# Altium schematic sheet FPGAGTP.SchDoc: Kasli-DIOT
size 420 x 297 mm; EDA_Number: ARTIQ; Projet: ARTIQ/SINARA; Author: G.Kasprowicz; CompanyName: WUT ISE; DrawnBy: F.Świtakowski; Organization: WUT ISE; Address1: PW ISE; Address2: Nowowiejska 15/19 00-665 Warsaw; Address3: gkasprow@gmail.com; DocumentNumber: 2; SheetNumber: 3; SheetTotal: 16; ModifiedBy: -; CheckedDate: -; Title2: FPGAGTP; DivGrp: WUT ISE; Designer: F.Świtakowski; ModifiedDate: -; ProjectName: Sensor Box
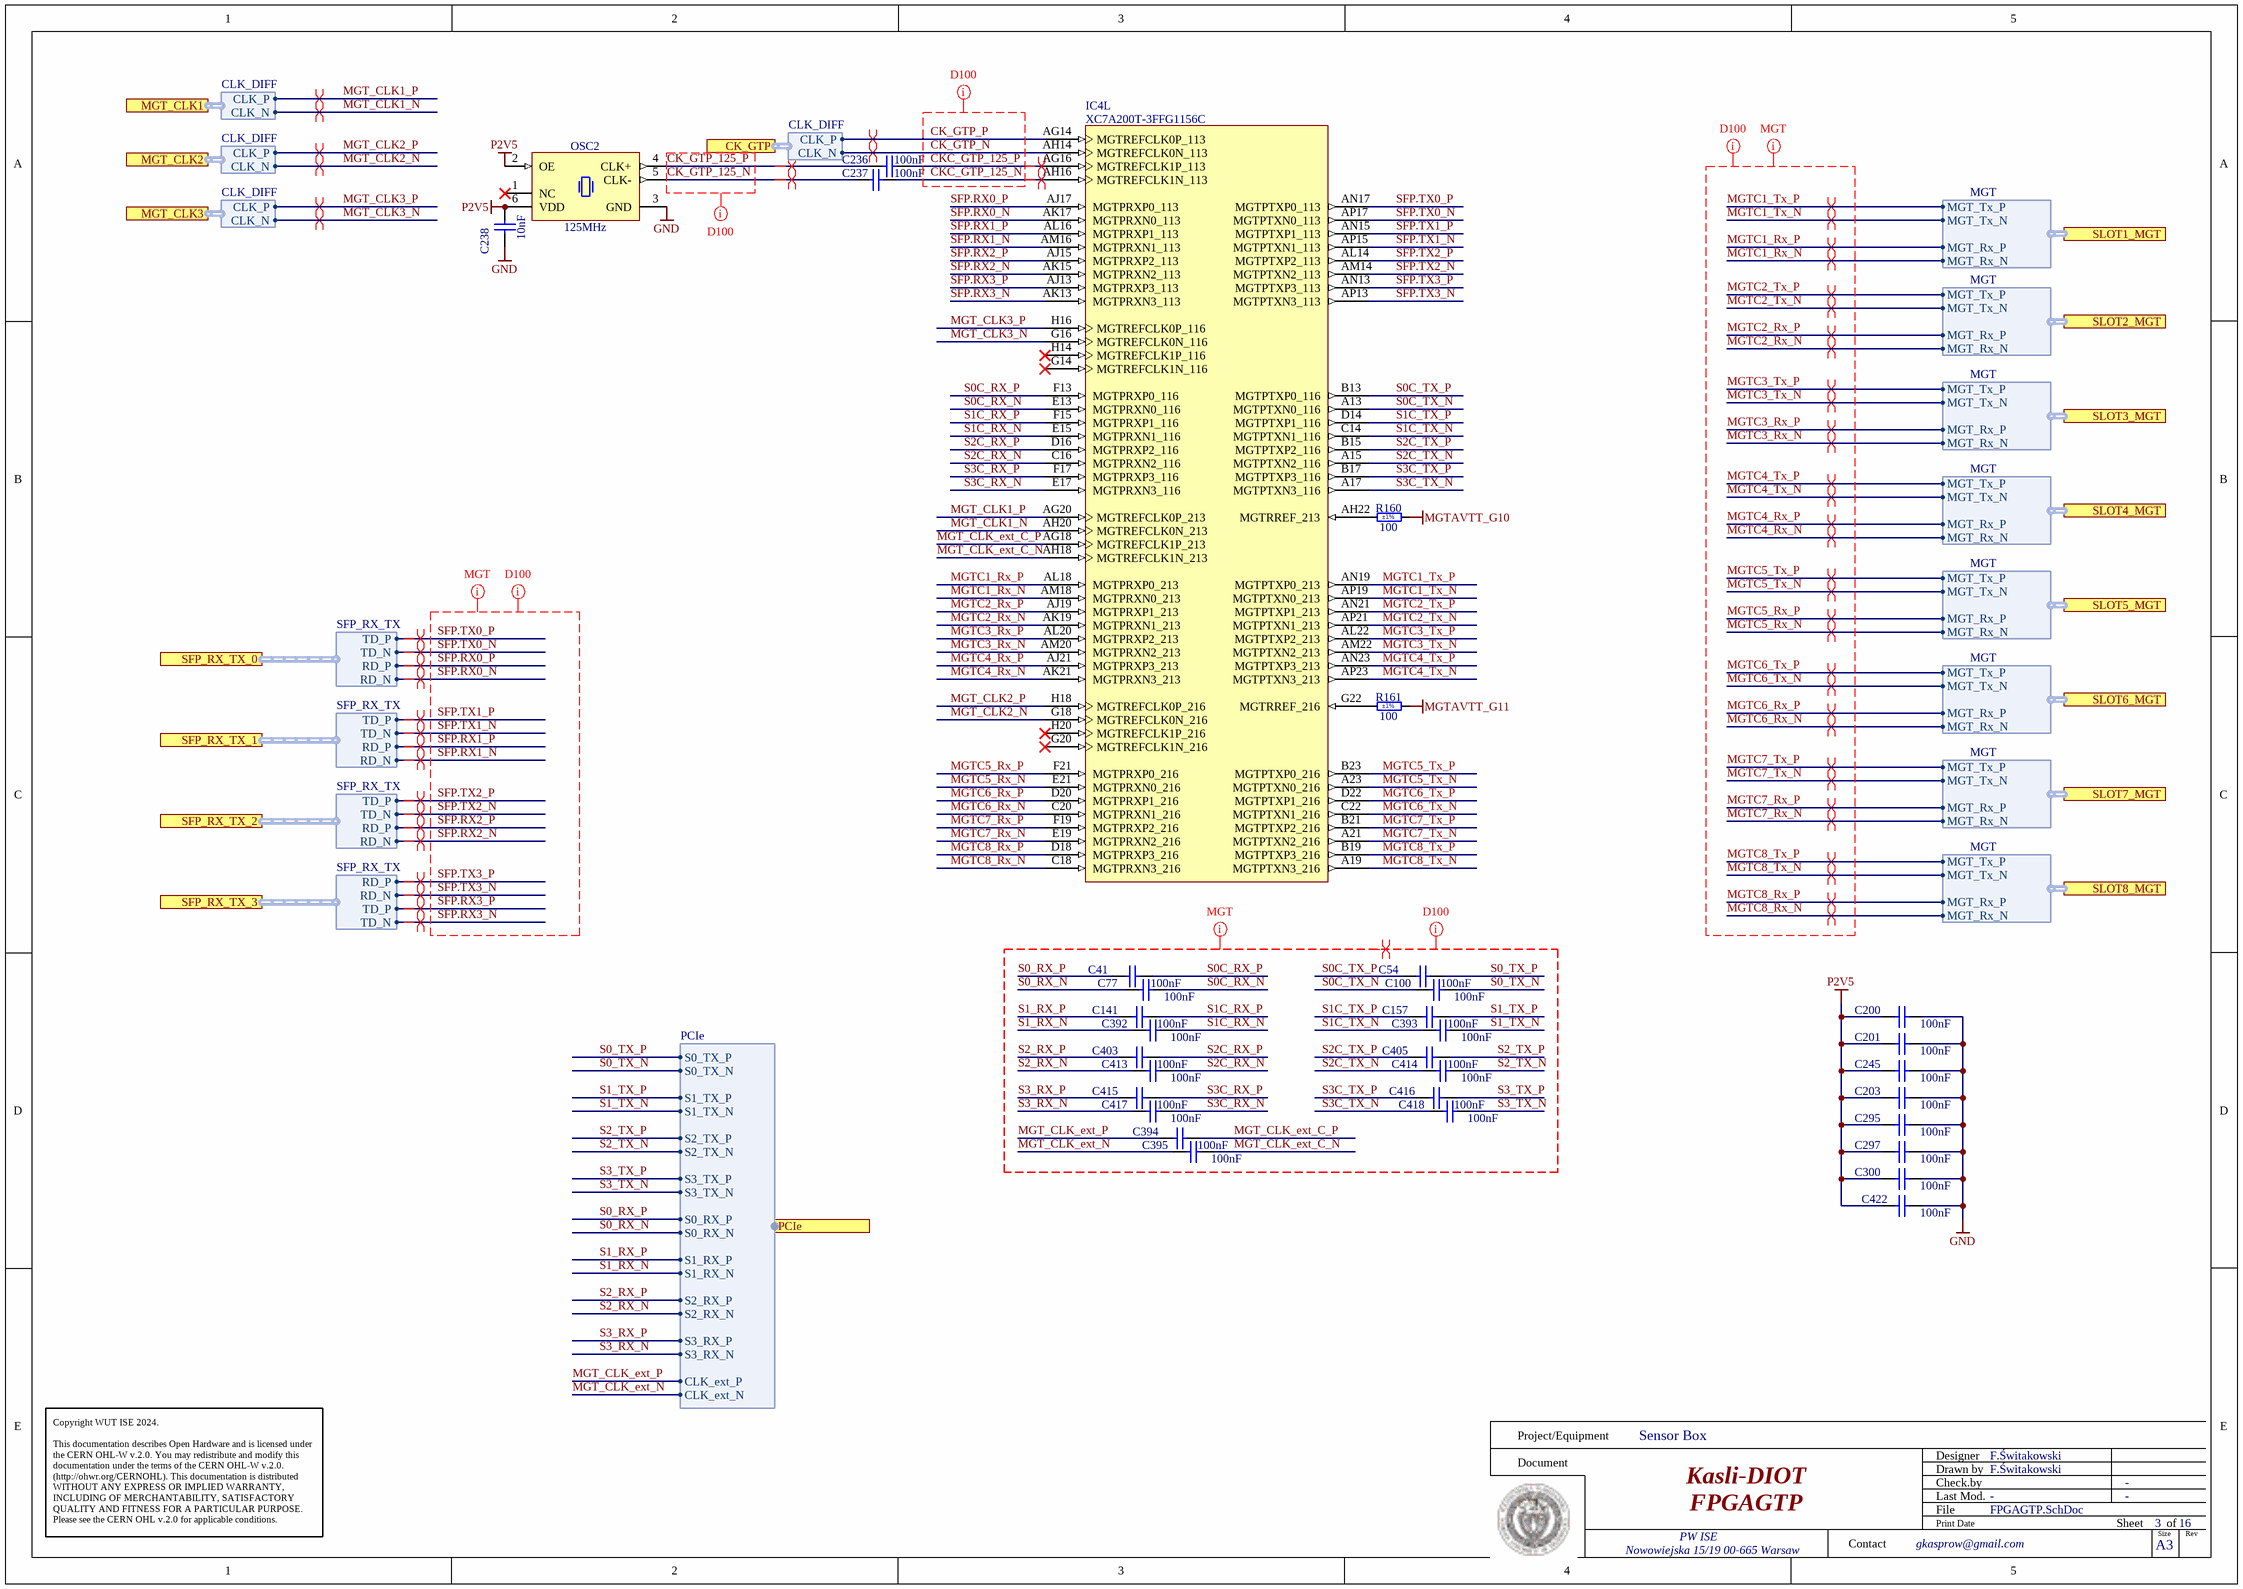
[diagram p0: FPGAGTP.SchDoc]

## Parts
C41  100nF  [CAPC0603X33N]
C54  100nF  [CAPC0603X33N]
C77  100nF  [CAPC0603X33N]
C100  100nF  [CAPC0603X33N]
C141  100nF  [CAPC0603X33N]
C157  100nF  [CAPC0603X33N]
C200  100nF  [CAPC0603X33N]
C201  100nF  [CAPC0603X33N]
C203  100nF  [CAPC0603X33N]
C236  100nF  [CAPC0603X33N]
C237  100nF  [CAPC0603X33N]
C238  10nF  [CAPC1005X55N]
C245  100nF  [CAPC0603X33N]
C295  100nF  [CAPC0603X33N]
C297  100nF  [CAPC0603X33N]
C300  100nF  [CAPC0603X33N]
C392  100nF  [CAPC0603X33N]
C393  100nF  [CAPC0603X33N]
C394  100nF  [CAPC0603X33N]
C395  100nF  [CAPC0603X33N]
C403  100nF  [CAPC0603X33N]
C405  100nF  [CAPC0603X33N]
C413  100nF  [CAPC0603X33N]
C414  100nF  [CAPC0603X33N]
C415  100nF  [CAPC0603X33N]
C416  100nF  [CAPC0603X33N]
C417  100nF  [CAPC0603X33N]
C418  100nF  [CAPC0603X33N]
C422  100nF  [CAPC0603X33N]
IC4  XC7A200T-3FFG1156C  [BGA1156C100P34X34_3500X3500X310]  (part L of 18)
OSC2  125MHz  [OSC_SILICON-LAB_SI510-6N]
R160  100  Tolerance: ±1%  [RESC0603X28N]
R161  100  Tolerance: ±1%  [RESC0603X28N]

## Ports
CK_GTP (harness CLK_DIFF), MGT_CLK1 (harness CLK_DIFF), MGT_CLK2 (harness CLK_DIFF), MGT_CLK3 (harness CLK_DIFF), PCIe (harness PCIe), SFP_RX_TX_0 (harness SFP_RX_TX), SFP_RX_TX_1 (harness SFP_RX_TX), SFP_RX_TX_2 (harness SFP_RX_TX), SFP_RX_TX_3 (harness SFP_RX_TX), SLOT1_MGT (harness MGT), SLOT2_MGT (harness MGT), SLOT3_MGT (harness MGT), SLOT4_MGT (harness MGT), SLOT5_MGT (harness MGT), SLOT6_MGT (harness MGT), SLOT7_MGT (harness MGT), SLOT8_MGT (harness MGT)

## Harnesses
SFP_RX_TX: RD_N, RD_P, TD_N, TD_P
MGT: MGT_Tx_P, MGT_Tx_N, MGT_Rx_P, MGT_Rx_N
CLK_DIFF: CLK_P, CLK_N
PCIe: S0_TX_P, S0_TX_N, S1_TX_P, S1_TX_N, S2_TX_P, S2_TX_N, S3_TX_P, S3_TX_N, S0_RX_P, S0_RX_N, S1_RX_P, S1_RX_N, S2_RX_P, S2_RX_N, S3_RX_P, S3_RX_N, CLK_ext_P, CLK_ext_N

## Nets
GND: C200.2 C201.2 C203.2 C238.1 C245.2 C295.2 C297.2 C300.2 C422.2 OSC2.3(GND)
MGTAVTT_G10: R160.2
MGTAVTT_G11: R161.2
P2V5: C200.1 C201.1 C203.1 C238.2 C245.1 C295.1 C297.1 C300.1 C422.1 OSC2.2(OE) OSC2.6(VDD)
CK_GTP_125_N: C237.1 OSC2.5(CLK-)
CK_GTP_125_P: C236.1 OSC2.4(CLK+)
CK_GTP_N: IC4.AH14(MGTREFCLK0N_113) ; port CK_GTP.CLK_N
CK_GTP_P: IC4.AG14(MGTREFCLK0P_113) ; port CK_GTP.CLK_P
CKC_GTP_125_N: C237.2 IC4.AH16(MGTREFCLK1N_113)
CKC_GTP_125_P: C236.2 IC4.AG16(MGTREFCLK1P_113)
MGT_CLK1_N: IC4.AH20(MGTREFCLK0N_213) ; port MGT_CLK1.CLK_N
MGT_CLK1_P: IC4.AG20(MGTREFCLK0P_213) ; port MGT_CLK1.CLK_P
MGT_CLK2_N: IC4.G18(MGTREFCLK0N_216) ; port MGT_CLK2.CLK_N
MGT_CLK2_P: IC4.H18(MGTREFCLK0P_216) ; port MGT_CLK2.CLK_P
MGT_CLK3_N: IC4.G16(MGTREFCLK0N_116) ; port MGT_CLK3.CLK_N
MGT_CLK3_P: IC4.H16(MGTREFCLK0P_116) ; port MGT_CLK3.CLK_P
MGT_CLK_ext_C_N: C395.2 IC4.AH18(MGTREFCLK1N_213)
MGT_CLK_ext_C_P: C394.2 IC4.AG18(MGTREFCLK1P_213)
MGT_CLK_ext_N: C395.1 ; port PCIe.CLK_ext_N
MGT_CLK_ext_P: C394.1 ; port PCIe.CLK_ext_P
MGTC1_Rx_N: IC4.AM18(MGTPRXN0_213) ; port SLOT1_MGT.MGT_Rx_N
MGTC1_Rx_P: IC4.AL18(MGTPRXP0_213) ; port SLOT1_MGT.MGT_Rx_P
MGTC1_Tx_N: IC4.AP19(MGTPTXN0_213) ; port SLOT1_MGT.MGT_Tx_N
MGTC1_Tx_P: IC4.AN19(MGTPTXP0_213) ; port SLOT1_MGT.MGT_Tx_P
MGTC2_Rx_N: IC4.AK19(MGTPRXN1_213) ; port SLOT2_MGT.MGT_Rx_N
MGTC2_Rx_P: IC4.AJ19(MGTPRXP1_213) ; port SLOT2_MGT.MGT_Rx_P
MGTC2_Tx_N: IC4.AP21(MGTPTXN1_213) ; port SLOT2_MGT.MGT_Tx_N
MGTC2_Tx_P: IC4.AN21(MGTPTXP1_213) ; port SLOT2_MGT.MGT_Tx_P
MGTC3_Rx_N: IC4.AM20(MGTPRXN2_213) ; port SLOT3_MGT.MGT_Rx_N
MGTC3_Rx_P: IC4.AL20(MGTPRXP2_213) ; port SLOT3_MGT.MGT_Rx_P
MGTC3_Tx_N: IC4.AM22(MGTPTXN2_213) ; port SLOT3_MGT.MGT_Tx_N
MGTC3_Tx_P: IC4.AL22(MGTPTXP2_213) ; port SLOT3_MGT.MGT_Tx_P
MGTC4_Rx_N: IC4.AK21(MGTPRXN3_213) ; port SLOT4_MGT.MGT_Rx_N
MGTC4_Rx_P: IC4.AJ21(MGTPRXP3_213) ; port SLOT4_MGT.MGT_Rx_P
MGTC4_Tx_N: IC4.AP23(MGTPTXN3_213) ; port SLOT4_MGT.MGT_Tx_N
MGTC4_Tx_P: IC4.AN23(MGTPTXP3_213) ; port SLOT4_MGT.MGT_Tx_P
MGTC5_Rx_N: IC4.E21(MGTPRXN0_216) ; port SLOT5_MGT.MGT_Rx_N
MGTC5_Rx_P: IC4.F21(MGTPRXP0_216) ; port SLOT5_MGT.MGT_Rx_P
MGTC5_Tx_N: IC4.A23(MGTPTXN0_216) ; port SLOT5_MGT.MGT_Tx_N
MGTC5_Tx_P: IC4.B23(MGTPTXP0_216) ; port SLOT5_MGT.MGT_Tx_P
MGTC6_Rx_N: IC4.C20(MGTPRXN1_216) ; port SLOT6_MGT.MGT_Rx_N
MGTC6_Rx_P: IC4.D20(MGTPRXP1_216) ; port SLOT6_MGT.MGT_Rx_P
MGTC6_Tx_N: IC4.C22(MGTPTXN1_216) ; port SLOT6_MGT.MGT_Tx_N
MGTC6_Tx_P: IC4.D22(MGTPTXP1_216) ; port SLOT6_MGT.MGT_Tx_P
MGTC7_Rx_N: IC4.E19(MGTPRXN2_216) ; port SLOT7_MGT.MGT_Rx_N
MGTC7_Rx_P: IC4.F19(MGTPRXP2_216) ; port SLOT7_MGT.MGT_Rx_P
MGTC7_Tx_N: IC4.A21(MGTPTXN2_216) ; port SLOT7_MGT.MGT_Tx_N
MGTC7_Tx_P: IC4.B21(MGTPTXP2_216) ; port SLOT7_MGT.MGT_Tx_P
MGTC8_Rx_N: IC4.C18(MGTPRXN3_216) ; port SLOT8_MGT.MGT_Rx_N
MGTC8_Rx_P: IC4.D18(MGTPRXP3_216) ; port SLOT8_MGT.MGT_Rx_P
MGTC8_Tx_N: IC4.A19(MGTPTXN3_216) ; port SLOT8_MGT.MGT_Tx_N
MGTC8_Tx_P: IC4.B19(MGTPTXP3_216) ; port SLOT8_MGT.MGT_Tx_P
S0_RX_N: C77.1 ; port PCIe.S0_RX_N
S0_RX_P: C41.1 ; port PCIe.S0_RX_P
S0_TX_N: C100.2 ; port PCIe.S0_TX_N
S0_TX_P: C54.2 ; port PCIe.S0_TX_P
S0C_RX_N: C77.2 IC4.E13(MGTPRXN0_116)
S0C_RX_P: C41.2 IC4.F13(MGTPRXP0_116)
S0C_TX_N: C100.1 IC4.A13(MGTPTXN0_116)
S0C_TX_P: C54.1 IC4.B13(MGTPTXP0_116)
S1_RX_N: C392.1 ; port PCIe.S1_RX_N
S1_RX_P: C141.1 ; port PCIe.S1_RX_P
S1_TX_N: C393.2 ; port PCIe.S1_TX_N
S1_TX_P: C157.2 ; port PCIe.S1_TX_P
S1C_RX_N: C392.2 IC4.E15(MGTPRXN1_116)
S1C_RX_P: C141.2 IC4.F15(MGTPRXP1_116)
S1C_TX_N: C393.1 IC4.C14(MGTPTXN1_116)
S1C_TX_P: C157.1 IC4.D14(MGTPTXP1_116)
S2_RX_N: C413.1 ; port PCIe.S2_RX_N
S2_RX_P: C403.1 ; port PCIe.S2_RX_P
S2_TX_N: C414.2 ; port PCIe.S2_TX_N
S2_TX_P: C405.2 ; port PCIe.S2_TX_P
S2C_RX_N: C413.2 IC4.C16(MGTPRXN2_116)
S2C_RX_P: C403.2 IC4.D16(MGTPRXP2_116)
S2C_TX_N: C414.1 IC4.A15(MGTPTXN2_116)
S2C_TX_P: C405.1 IC4.B15(MGTPTXP2_116)
S3_RX_N: C417.1 ; port PCIe.S3_RX_N
S3_RX_P: C415.1 ; port PCIe.S3_RX_P
S3_TX_N: C418.2 ; port PCIe.S3_TX_N
S3_TX_P: C416.2 ; port PCIe.S3_TX_P
S3C_RX_N: C417.2 IC4.E17(MGTPRXN3_116)
S3C_RX_P: C415.2 IC4.F17(MGTPRXP3_116)
S3C_TX_N: C418.1 IC4.A17(MGTPTXN3_116)
S3C_TX_P: C416.1 IC4.B17(MGTPTXP3_116)
SFP.RX0_N: IC4.AK17(MGTPRXN0_113) ; port SFP_RX_TX_0.RD_N
SFP.RX0_P: IC4.AJ17(MGTPRXP0_113) ; port SFP_RX_TX_0.RD_P
SFP.RX1_N: IC4.AM16(MGTPRXN1_113) ; port SFP_RX_TX_1.RD_N
SFP.RX1_P: IC4.AL16(MGTPRXP1_113) ; port SFP_RX_TX_1.RD_P
SFP.RX2_N: IC4.AK15(MGTPRXN2_113) ; port SFP_RX_TX_2.RD_N
SFP.RX2_P: IC4.AJ15(MGTPRXP2_113) ; port SFP_RX_TX_2.RD_P
SFP.RX3_N: IC4.AK13(MGTPRXN3_113) ; port SFP_RX_TX_3.TD_N
SFP.RX3_P: IC4.AJ13(MGTPRXP3_113) ; port SFP_RX_TX_3.TD_P
SFP.TX0_N: IC4.AP17(MGTPTXN0_113) ; port SFP_RX_TX_0.TD_N
SFP.TX0_P: IC4.AN17(MGTPTXP0_113) ; port SFP_RX_TX_0.TD_P
SFP.TX1_N: IC4.AP15(MGTPTXN1_113) ; port SFP_RX_TX_1.TD_N
SFP.TX1_P: IC4.AN15(MGTPTXP1_113) ; port SFP_RX_TX_1.TD_P
SFP.TX2_N: IC4.AM14(MGTPTXN2_113) ; port SFP_RX_TX_2.TD_N
SFP.TX2_P: IC4.AL14(MGTPTXP2_113) ; port SFP_RX_TX_2.TD_P
SFP.TX3_N: IC4.AP13(MGTPTXN3_113) ; port SFP_RX_TX_3.RD_N
SFP.TX3_P: IC4.AN13(MGTPTXP3_113) ; port SFP_RX_TX_3.RD_P
NetIC4_AH22: IC4.AH22(MGTRREF_213) R160.1
NetIC4_G22: IC4.G22(MGTRREF_216) R161.1

Not connected (* = marked no-connect by the designer): IC4 G14(MGTREFCLK1N_116)* G20(MGTREFCLK1N_216)* H14(MGTREFCLK1P_116)* H20(MGTREFCLK1P_216)*; OSC2 1(NC)*

## Layout directives
differential pair: CK_GTP_125_N, CK_GTP_125_P, CK_GTP_N, CK_GTP_P, CKC_GTP_125_N, CKC_GTP_125_P, MGT_CLK1_N, MGT_CLK1_P, MGT_CLK2_N, MGT_CLK2_P, MGT_CLK3_N, MGT_CLK3_P, MGT_CLK_ext_C_N, MGT_CLK_ext_C_P, MGT_CLK_ext_N, MGT_CLK_ext_P, MGTC1_Rx_N, MGTC1_Rx_P, MGTC1_Tx_N, MGTC1_Tx_P, MGTC2_Rx_N, MGTC2_Rx_P, MGTC2_Tx_N, MGTC2_Tx_P, MGTC3_Rx_N, MGTC3_Rx_P, MGTC3_Tx_N, MGTC3_Tx_P, MGTC4_Rx_N, MGTC4_Rx_P, MGTC4_Tx_N, MGTC4_Tx_P, MGTC5_Rx_N, MGTC5_Rx_P, MGTC5_Tx_N, MGTC5_Tx_P, MGTC6_Rx_N, MGTC6_Rx_P, MGTC6_Tx_N, MGTC6_Tx_P, MGTC7_Rx_N, MGTC7_Rx_P, MGTC7_Tx_N, MGTC7_Tx_P, MGTC8_Rx_N, MGTC8_Rx_P, MGTC8_Tx_N, MGTC8_Tx_P, S0_RX_N, S0_RX_P, S0_TX_N, S0_TX_P, S0C_RX_N, S0C_RX_P, S0C_TX_N, S0C_TX_P, S1_RX_N, S1_RX_P, S1_TX_N, S1_TX_P, S1C_RX_N, S1C_RX_P, S1C_TX_N, S1C_TX_P, S2_RX_N, S2_RX_P, S2_TX_N, S2_TX_P, S2C_RX_N, S2C_RX_P, S2C_TX_N, S2C_TX_P, S3_RX_N, S3_RX_P, S3_TX_N, S3_TX_P, S3C_RX_N, S3C_RX_P, S3C_TX_N, S3C_TX_P, SFP.RX0_N, SFP.RX0_P, SFP.RX1_N, SFP.RX1_P, SFP.RX2_N, SFP.RX2_P, SFP.RX3_N, SFP.RX3_P, SFP.TX0_N, SFP.TX0_P, SFP.TX1_N, SFP.TX1_P, SFP.TX2_N, SFP.TX2_P, SFP.TX3_N, SFP.TX3_P
net class MGT: MGT_CLK_ext_C_N, MGT_CLK_ext_C_P, MGT_CLK_ext_N, MGT_CLK_ext_P, MGTC1_Rx_N, MGTC1_Rx_P, MGTC1_Tx_N, MGTC1_Tx_P, MGTC2_Rx_N, MGTC2_Rx_P, MGTC2_Tx_N, MGTC2_Tx_P, MGTC3_Rx_N, MGTC3_Rx_P, MGTC3_Tx_N, MGTC3_Tx_P, MGTC4_Rx_N, MGTC4_Rx_P, MGTC4_Tx_N, MGTC4_Tx_P, MGTC5_Rx_N, MGTC5_Rx_P, MGTC5_Tx_N, MGTC5_Tx_P, MGTC6_Rx_N, MGTC6_Rx_P, MGTC6_Tx_N, MGTC6_Tx_P, MGTC7_Rx_N, MGTC7_Rx_P, MGTC7_Tx_N, MGTC7_Tx_P, MGTC8_Rx_N, MGTC8_Rx_P, MGTC8_Tx_N, MGTC8_Tx_P, S0_RX_N, S0_RX_P, S0_TX_N, S0_TX_P, S0C_RX_N, S0C_RX_P, S0C_TX_N, S0C_TX_P, S1_RX_N, S1_RX_P, S1_TX_N, S1_TX_P, S1C_RX_N, S1C_RX_P, S1C_TX_N, S1C_TX_P, S2_RX_N, S2_RX_P, S2_TX_N, S2_TX_P, S2C_RX_N, S2C_RX_P, S2C_TX_N, S2C_TX_P, S3_RX_N, S3_RX_P, S3_TX_N, S3_TX_P, S3C_RX_N, S3C_RX_P, S3C_TX_N, S3C_TX_P, SFP.RX0_N, SFP.RX0_P, SFP.RX1_N, SFP.RX1_P, SFP.RX2_N, SFP.RX2_P, SFP.RX3_N, SFP.RX3_P, SFP.TX0_N, SFP.TX0_P, SFP.TX1_N, SFP.TX1_P, SFP.TX2_N, SFP.TX2_P, SFP.TX3_N, SFP.TX3_P
net class D100: CK_GTP_125_N, CK_GTP_125_P, CK_GTP_N, CK_GTP_P, CKC_GTP_125_N, CKC_GTP_125_P, MGT_CLK_ext_C_N, MGT_CLK_ext_C_P, MGT_CLK_ext_N, MGT_CLK_ext_P, MGTC1_Rx_N, MGTC1_Rx_P, MGTC1_Tx_N, MGTC1_Tx_P, MGTC2_Rx_N, MGTC2_Rx_P, MGTC2_Tx_N, MGTC2_Tx_P, MGTC3_Rx_N, MGTC3_Rx_P, MGTC3_Tx_N, MGTC3_Tx_P, MGTC4_Rx_N, MGTC4_Rx_P, MGTC4_Tx_N, MGTC4_Tx_P, MGTC5_Rx_N, MGTC5_Rx_P, MGTC5_Tx_N, MGTC5_Tx_P, MGTC6_Rx_N, MGTC6_Rx_P, MGTC6_Tx_N, MGTC6_Tx_P, MGTC7_Rx_N, MGTC7_Rx_P, MGTC7_Tx_N, MGTC7_Tx_P, MGTC8_Rx_N, MGTC8_Rx_P, MGTC8_Tx_N, MGTC8_Tx_P, S0_RX_N, S0_RX_P, S0_TX_N, S0_TX_P, S0C_RX_N, S0C_RX_P, S0C_TX_N, S0C_TX_P, S1_RX_N, S1_RX_P, S1_TX_N, S1_TX_P, S1C_RX_N, S1C_RX_P, S1C_TX_N, S1C_TX_P, S2_RX_N, S2_RX_P, S2_TX_N, S2_TX_P, S2C_RX_N, S2C_RX_P, S2C_TX_N, S2C_TX_P, S3_RX_N, S3_RX_P, S3_TX_N, S3_TX_P, S3C_RX_N, S3C_RX_P, S3C_TX_N, S3C_TX_P, SFP.RX0_N, SFP.RX0_P, SFP.RX1_N, SFP.RX1_P, SFP.RX2_N, SFP.RX2_P, SFP.RX3_N, SFP.RX3_P, SFP.TX0_N, SFP.TX0_P, SFP.TX1_N, SFP.TX1_P, SFP.TX2_N, SFP.TX2_P, SFP.TX3_N, SFP.TX3_P

## Notes on the sheet
- Project/Equipment
- Document
- Designer
- Drawn by
- Check.by
- Copyright WUT ISE 2024.
  This documentation describes Open Hardware and is licensed under the CERN OHL-W v.2.0. You may redistribute and modify this documentation under the terms of the CERN OHL-W v.2.0. (http://ohwr.org/CERNOHL). This documentation is distributed WITHOUT ANY EXPRESS OR IMPLIED WARRANTY, INCLUDING OF MERCHANTABILITY, SATISFACTORY QUALITY AND FITNESS FOR A PARTICULAR PURPOSE. Please see the CERN OHL v.2.0 for applicable conditions.
- Contact
- File
- Last Mod.
- Print Date
- Sheet
- Size
- A3
- of
- Rev

## Library data of the parts
C41 C54 C77 C100 C141 C157 C200 C201 C203 C236 C237 C245 C295 C297 C300 C392-C395 C403 C405 C413-C418 C422 = CC0201_100NF_6.3V_10%_X5R: Non-polarised capacitor; Part Description: SMD Multilayer Chip Ceramic Capacitor; Manufacturer: GENERIC; Manufacturer1 Part Number: 02016D104KAT2A; Voltage: 6.3V; TC: X5R; Tolerance: ±10%; Part Number: CC0201_100NF_6.3V_10%_X5R; Component Kind: Standard; Component Type: Standard; Pin Count: 2; Value: 100nF; Status: Not Recommended; Manufacturer Part Number: CC0201_100NF_6.3V_10%_X5R; Case: 0201; Mounted: Yes; Socket: No; SMD: Yes; Sense: No; Manufacturer1 Example: AVX; Manufacturer1 ComponentHeight: 0.33mm; HelpURL: \\cern.ch\dfs\Applications\Altium\Datasheets\CC0201_X5R_AVX.pdf; Author: CERN DEM JLC; CreateDate: 2007-12-03; LatestRevisionDate: 2007-12-03
C238 = CC0402_10NF_16V_10%_X7R: Non-polarised capacitor; Part Description: SMD Multilayer Chip Ceramic Capacitor; Manufacturer: GENERIC; Manufacturer1 Part Number: 223878715636; Voltage: 16V; TC: X7R; Tolerance: ±10%; Part Number: CC0402_10NF_16V_10%_X7R; Component Kind: Standard; Component Type: Standard; Pin Count: 2; Value: 10nF; Status: Not Recommended; Manufacturer Part Number: CC0402_10NF_16V_10%_X7R; Case: 0402; Mounted: Yes; Socket: No; SMD: Yes; Sense: No; Manufacturer1 Example: PHYCOMP; Manufacturer1 ComponentHeight: 0.55mm; HelpURL: \\cern.ch\dfs\Applications\Altium\Datasheets\CC0402_X7R_PHYCOMP.pdf; Author: CERN DEM JLC; CreateDate: 03.12.2007; LatestRevisionDate: 03.12.2007
IC4 = XC7A200T-3FFG1156C: Artix-7 FPGA, 500 User I/Os, 16 GTP, 1156-Ball BGA, , Speed Grade 3, Commercial Grade, Pb-Free; Part Description: Artix-7 FPGA, 500 User I/Os, 16 GTP, 1156-Ball BGA, Speed Grade 3, Commercial Grade, Pb-Free; Manufacturer: XILINX; PressFit: No; Bonding: No; Part Number: XC7A200T-3FFG1156C; Component Kind: Standard; Component Type: Standard; Device: XC7A200T-3FFG1156C; PackageDescription: BGA, 1.00mm Pitch, Square; 1156 Pin, 34 Columns X 34 Rows, Body 35.00mm X 35.0mm X 3.10mm H, IPC Medium Density; Manufacturer Part Number: XC7A200T-3FFG1156C; Pin Count: 1156; Case: BGA1156; Mounted: Yes; Socket: No; SMD: Yes; Sense: No; ComponentHeight: 3.1mm; HelpURL: \\cern.ch\dfs\Applications\Altium\Datasheets\XC7A200T-3FFG1156C.pdf; ComponentLink1URL: \\cern.ch\dfs\Applications\Altium\Datasheets\XC7A200T-3FFG1156C_Package.pdf; ComponentLink1Description: Package; ComponentLink2URL: \\cern.ch\dfs\Applications\Altium\Datasheets\XC7A200T-3FFG1156C_Pinout.txt; ComponentLink2Description: Pinout; Author: CERN DEM JLC; CreateDate: 07.11.2016; LatestRevisionDate: 07.11.2016
OSC2 = OSC_125MHZ_SILICON-LAB_510FBA125M000AAG: Crystal Oscillator 6 pins, Si510 (LVDS/LVPECL/HCSL/Dual CMOS); Part Description: 2.5V ±25ppm LVDS Crystal Oscillator (XO), Si510 Series; Manufacturer: SILICON LABS; PressFit: No; Bonding: No; Part Number: OSC_125MHZ_SILICON-LAB_510FBA125M000AAG; Component Kind: Standard; Component Type: Standard; PackageDescription: Oscillator Si510 Series, 6 pins, 5x7mm; Value: 125MHz; Manufacturer Part Number: 510FBA125M000AAG; Pin Count: 6; Mounted: Yes; Socket: No; SMD: Yes; Sense: No; ComponentHeight: 1.8mm; HelpURL: \\cern.ch\dfs\Applications\Altium\Datasheets\OSC_SILICON-LAB_SI510.pdf; Author: CERN DEM JMW; CreateDate: 2015-08-10; LatestRevisionDate: 2015-08-10
R160 R161 = R0201_100R_1%_0.05W_200PPM: Resistor - 1%; Part Description: Thick Film Chip Resistor; Manufacturer: GENERIC; Manufacturer1 Part Number: CRCW0201100RFNED; Power: 0.05W; TC: ±200ppm/°C; PressFit: No; Part Number: R0201_100R_1%_0.05W_200PPM; Component Kind: Standard; Component Type: Standard; Pin Count: 2; Value: 100; Status: Not Recommended; Manufacturer Part Number: R0201_100R_1%_0.05W_200PPM; Case: 0201; Mounted: Yes; Sense: No; Socket: No; SMD: Yes; Manufacturer1 Example: VISHAY; Manufacturer1 ComponentHeight: 0.27mm; HelpURL: \\cern.ch\dfs\Applications\Altium\Datasheets\R0201_VISHAY_CRCW e3.pdf; Author: CERN DEM JLC; CreateDate: 13.11.2014; LatestRevisionDate: 13.11.2014